# EAGLE design Astable Multivibrator (EAGLE 9.0.1)
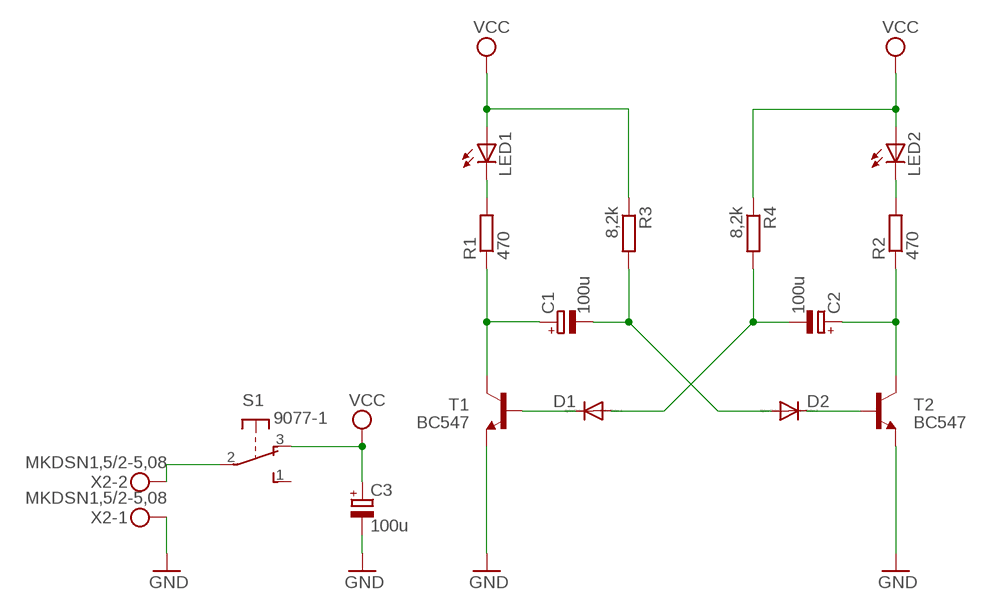
[diagram p0: schematic, sheet 1]

## Parts
C1  100u  CPOL-EUE2.5-6  [E2,5-6]
C2  100u  CPOL-EUE2.5-6  [E2,5-6]
C3  100u  CPOL-EUE2.5-6  [E2,5-6]
D1  1N4148DO35-7  [DO35-7]
D2  1N4148DO35-7  [DO35-7]
LED1  LED5MM  [LED5MM]
LED2  LED5MM  [LED5MM]
R1  470  R-EU_0207/10  [0207/10]
R2  470  R-EU_0207/10  [0207/10]
R3  8,2k  R-EU_0207/10  [0207/10]
R4  8,2k  R-EU_0207/10  [0207/10]
S1  9077-1  [9077-1]
T1  BC547  BC547B  [TO92]
T2  BC547  BC547B  [TO92]
X2  MKDSN1,5/2-5,08  [MKDSN1,5/2-5,08]

## Nets
GND: C3.- T1.1(E) T2.1(E) X2.1
N$1: LED1.K(C) R1.2
N$2: C1.+ R1.1 T1.3(C)
N$3: S1.2(P) X2.2
N$4: D1.C T1.2(B)
N$5: C2.- D1.A R4.2
N$6: C1.- D2.A R3.2
N$7: LED2.K(C) R2.2
N$8: D2.C T2.2(B)
N$11: C2.+ R2.1 T2.3(C)
VCC: C3.+ LED1.A LED2.A R3.1 R4.1 S1.3(O)
Unconnected: S1.1(S)

## Library data of the parts
C1-C3 = rcl:CPOL-EU: POLARIZED CAPACITOR, European symbol; SPICEPREFIX: C
D1 D2 = diode:1N4148: DIODE high speed (Philips)
LED1 LED2 = led:LED: LED OSRAM: - CHIPLED LG R971, LG N971, LY N971, LG Q971, LY Q971, LO R971, LY R971 LH N974, LH R974 LS Q976, LO Q976, LY Q976 LO Q996 - Hyper CHIPLED LW Q18S LB Q993, LB Q99A, LB R99A - SideLED LS A670, LO A670, LY A670, LG A670, LP A670 LB A673, LV A673, LT A673, LW A673 LH A674 LY A675 LS A676, LA A676, LO A676, LY A676, LW A676 LS A679, LY A679, LG A679 - Hyper Micro SIDELED® LS Y876, LA Y876, LO Y876, LY Y876 LT Y87S - SmartLED LW L88C, LW L88S LB L89C, LB L89S, LG L890 LS L89K, LO L89K, LY L89K LS L896, LA L896, LO L896, LY L896 - TOPLED LS T670, LO T670, LY T670, LG T670, LP T670 LSG T670, LSP T670, LSY T670, LOP T670, LYG T670 LG T671, LOG T671, LSG T671 LB T673, LV T673, LT T673, LW T673 LH T674 LS T676, LA T676, LO T676, LY T676, LB T676, LH T676, LSB T676, LW T676 LB T67C, LV T67C, LT T67C, LS T67K, LO T67K, LY T67K, LW E67C LS E67B, LA E67B, LO E67B, LY E67B, LB E67C, LV E67C, LT E67C LW T67C LS T679, LY T679, LG T679 LS T770, LO T770, LY T770, LG T770, LP T770 LB T773, LV T773, LT T773, LW T773 LH T774 LS E675, LA E675, LY E675, LS T675 LS T776, LA T776, LO T776, LY T776, LB T776 LHGB T686 LT T68C, LB T68C - Hyper Mini TOPLED® LB M676 - Mini TOPLED Santana® LG M470 LS M47K, LO M47K, LY M47K Source: http://www.osram.convergy.de LUXEON: - LUMILED® LXK2-PW12-R00, LXK2-PW12-S00, LXK2-PW14-U00, LXK2-PW14-V00 LXK2-PM12-R00, LXK2-PM12-S00, LXK2-PM14-U00 LXK2-PE12-Q00, LXK2-PE12-R00, LXK2-PE12-S00, LXK2-PE14-T00, LXK2-PE14-U00 LXK2-PB12-K00, LXK2-PB12-L00, LXK2-PB12-M00, LXK2-PB14-N00, LXK2-PB14-P00, LXK2-PB14-Q00 LXK2-PR12-L00, LXK2-PR12-M00, LXK2-PR14-Q00, LXK2-PR14-R00 LXK2-PD12-Q00, LXK2-PD12-R00, LXK2-PD12-S00 LXK2-PH12-R00, LXK2-PH12-S00 LXK2-PL12-P00, LXK2-PL12-Q00, LXK2-PL12-R00 Source: www.luxeon.com KINGBRIGHT: KA-3528ASYC Source: www.kingbright.com
R1-R4 = rcl:R-EU_: RESISTOR, European symbol; SPICEPREFIX: R
S1 = switch-misc:9077-1: MARQUARDT SWITCH 9077.0100 Distributor: Buerklin <https://www.buerklin.com/default.asp?event=ShowArtikel%2812G2820%29&l=d&jump=ArtNr_12G2820>
T1 T2 = transistor-npn:BC547*: NPN Transistor
X2 = con-phoenix-508:MKDSN1,5/2-5,08: MKDSN 1,5/ 2-5,08 Printklemme Nennstrom: 13,5 A Nennspannung: 250 V Rastermaß: 5,08 mm Polzahl: 2 Anschlussart: Schraubanschluss Montage: Löten Anschlussrichtung Leiter/Platine: 0 ° Artikelnummer: 1729128 Source: http://eshop.phoenixcontact.com .. 1729128.pdf

## Board
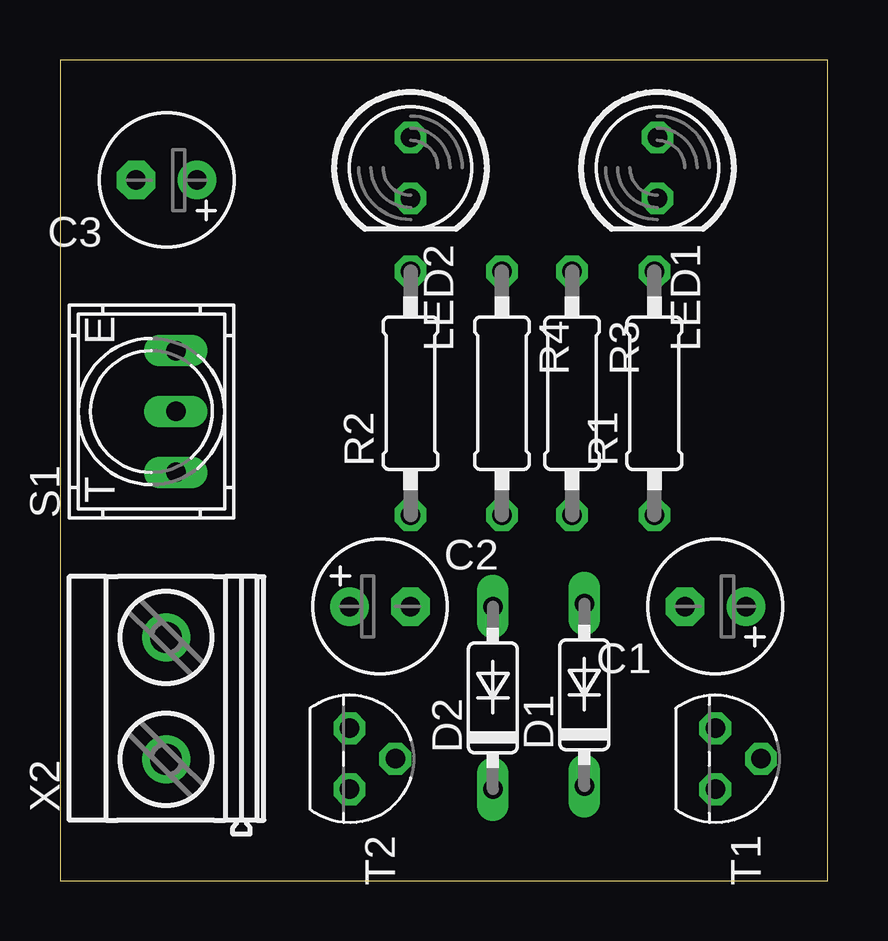
[diagram p1: board, top side]
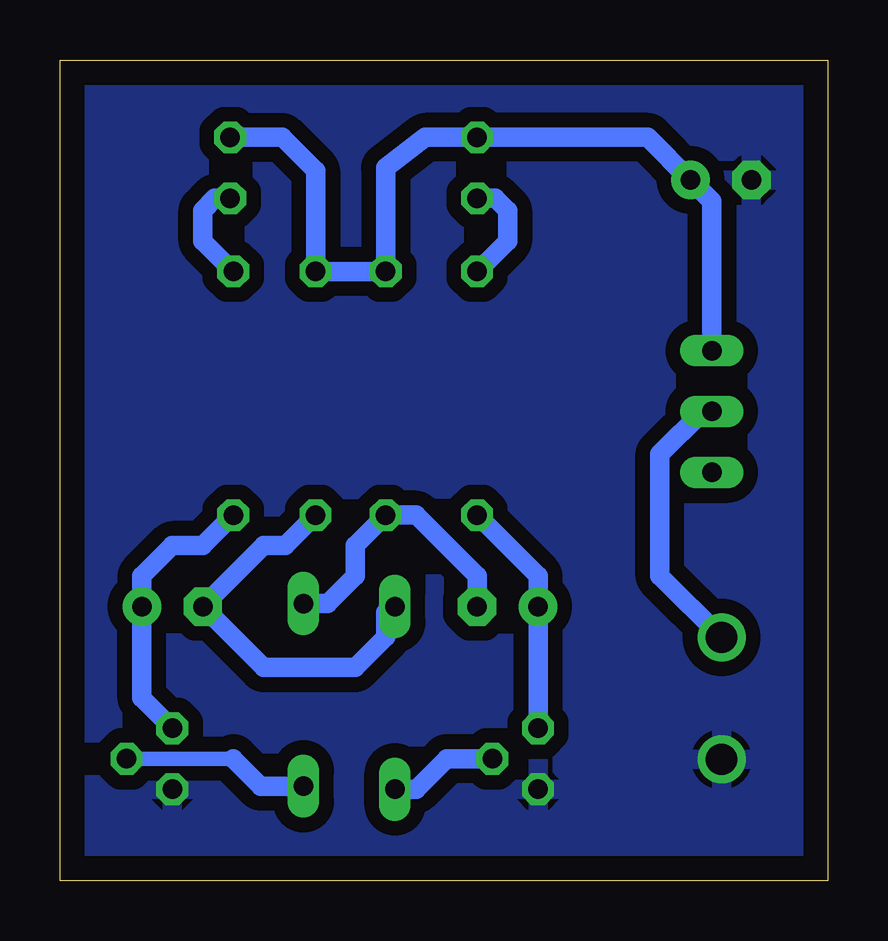
[diagram p2: board, bottom side, seen from below]

Size 31.98 x 34.21 mm. Coordinates in mm from the lower left corner, seen from the top.
Outline: 0,0 31.98,0 31.98,34.21 0,34.21 0,0
Copper layers (1*16): Top 0.035mm / dielectric 1.5mm / Bottom 0.035mm
Design rules "default": minimum track width 6mil, minimum drill 0.35mm, track to track 6mil, track to pad 6mil, pad to pad 6mil, via to via 6mil, smd to smd 6mil, copper to edge 40mil, drill to drill 6mil, minimum pad ring 10mil, minimum via ring 8mil, stop-mask expansion 4mil, vias tented up to drill 0mil, thermal gap 10mil

### Footprints (pad centres in the part's own frame; a part is rotated, then mirrored left to right if it is on the bottom)
E2,5-6 = drill 0.813 pad 1.6: + -1.27,0 | drill 0.813 pad 1.6 octagon: - 1.27,0
DO35-7 = drill 0.813 long: A 3.81,0; C -3.81,0
LED5MM = drill 0.813 octagon: A -1.27,0; K 1.27,0
0207/10 = drill 0.813 octagon: 1 -5.08,0; 2 5.08,0
9077-1 = drill 0.813 long: 1 -2.54,-1.016; 2 0,-1.016; 3 2.54,-1.016
TO92 = drill 0.813 octagon: 1 1.27,0; 2 0,1.905; 3 -1.27,0
MKDSN1,5/2-5,08 = drill 1.3 pad 2: 1 -2.561,0.025; 2 2.519,0.025

### Placement (x,y rotation side)
C1  27.3,11.43 180 top
C2  13.34,11.43 0 top
C3  4.45,29.21 180 top
D1  21.84,7.75 90 top
D2  18.03,7.62 90 top
LED1  24.89,29.72 270 top
LED2  14.61,29.72 270 top
R1  24.76,20.32 90 top
R2  14.61,20.32 90 top
R3  21.34,20.32 270 top
R4  18.41,20.32 270 top
S1  3.81,19.56 90 top
T1  27.3,5.08 270 top
T2  12.06,5.08 270 top
X2  4.45,7.62 90 top

### Tracks (layer width: path | path; a pad name or v marks a point on that pad's centre or on a via)
GND
  pour Bottom (isolate 0.61): -1.91,35.56 32.39,35.56 32.39,-1.27 -1.91,-1.27
N$1
  Bottom 0.813: R1.2 26.04,26.67 26.04,27.94 25.53,28.45 LED1.K
N$2
  Bottom 0.813: T1.3 28.57,7.62 C1.+ 28.57,12.7 27.3,13.97 26.04,13.97 R1.1
N$3
  Bottom 0.813: X2.2 6.99,12.7 6.99,17.78 5.21,19.56 S1.2
N$4
  Bottom 0.61: 24.76,5.08 T1.2
  Bottom 0.813: D1.C 23.62,3.94 24.76,5.08
N$5
  Bottom 0.813: D1.A 20.83,11.56 19.68,12.7 19.68,13.97 R4.2 17.14,15.24 14.61,12.7 C2.-
N$6
  Bottom 0.813: D2.A 18.29,11.18 18.41,11.18 18.41,10.16 19.68,8.89 23.49,8.89 C1.- 23.49,13.97 22.61,13.97 R3.2
N$7
  Bottom 0.813: LED2.K 13.84,28.45 13.34,27.94 13.34,26.67 R2.2
N$8
  Bottom 0.813: T2.2 15.88,5.08 17.14,3.81 D2.C
N$11
  Bottom 0.813: T2.3 C2.+ 12.06,12.7 R2.1
VCC
  Bottom 0.813: S1.3 4.83,28.32 C3.+ 7.49,30.99 LED2.A 16.76,30.99 18.41,29.72 R4.1 R3.1 21.34,29.59 22.73,30.99 LED1.A